# EasyEDA Pro project ProPrj_AIoT-NTU-Prototype_2026-03-28.epro, board Extension Board
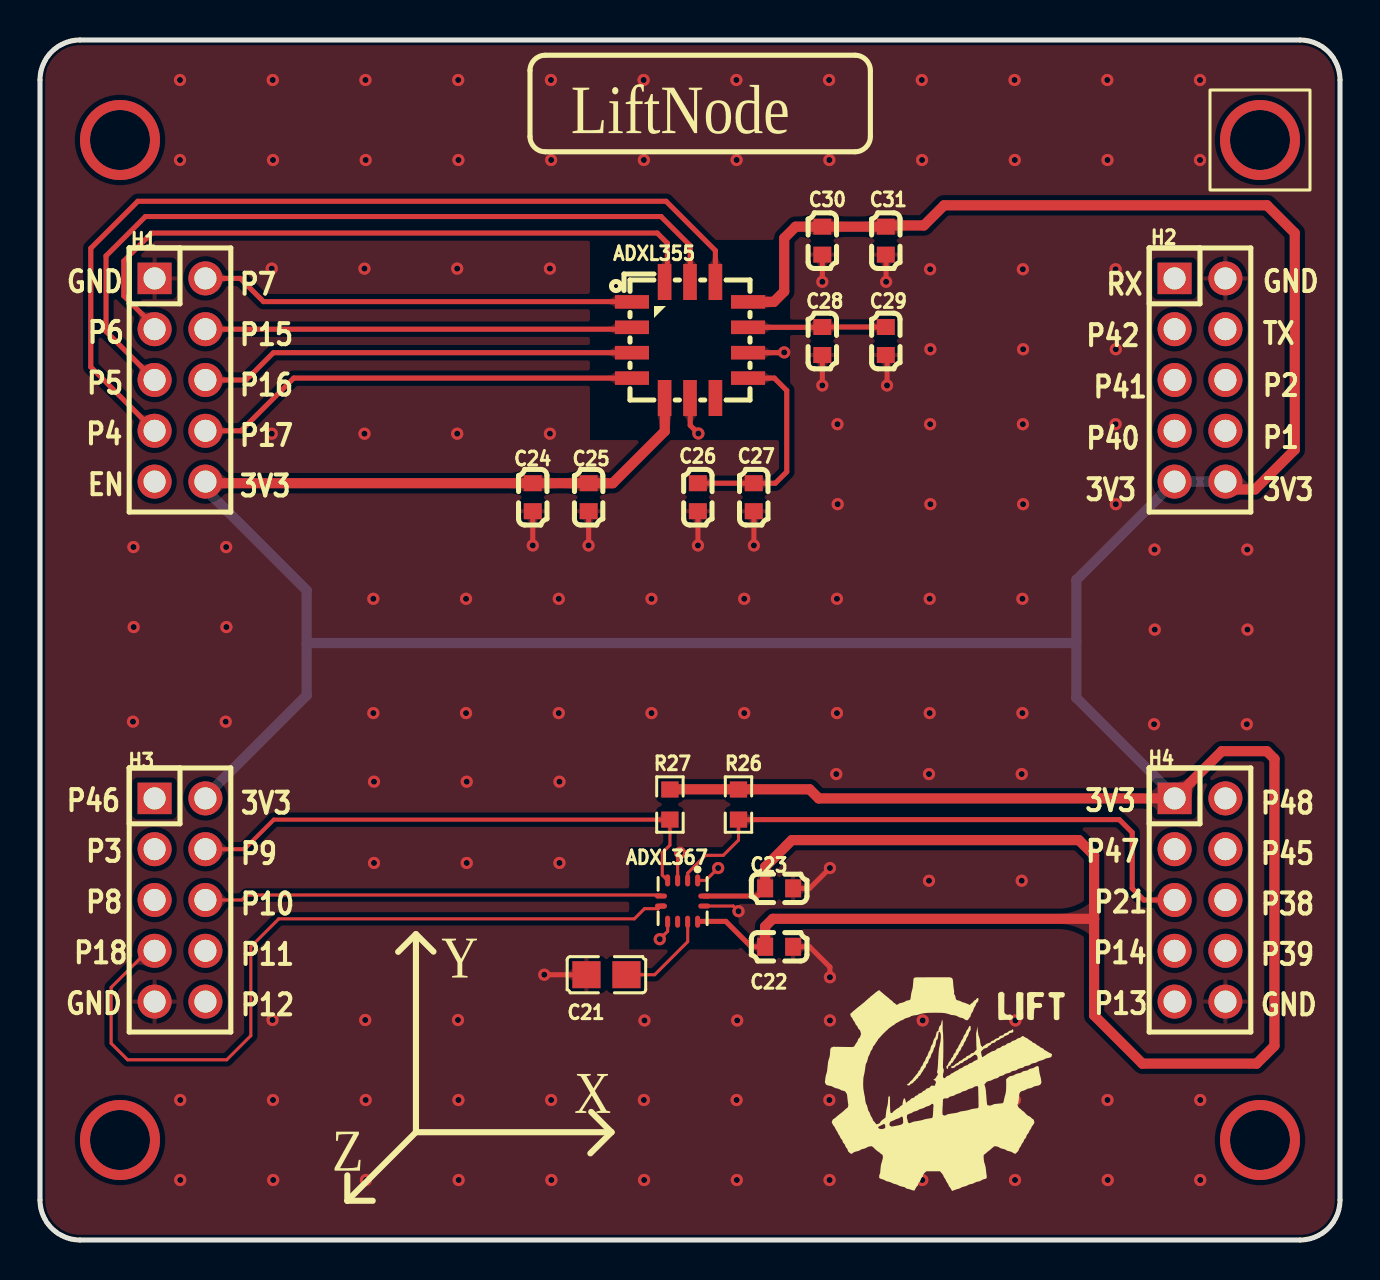
[diagram p5: board, top side]
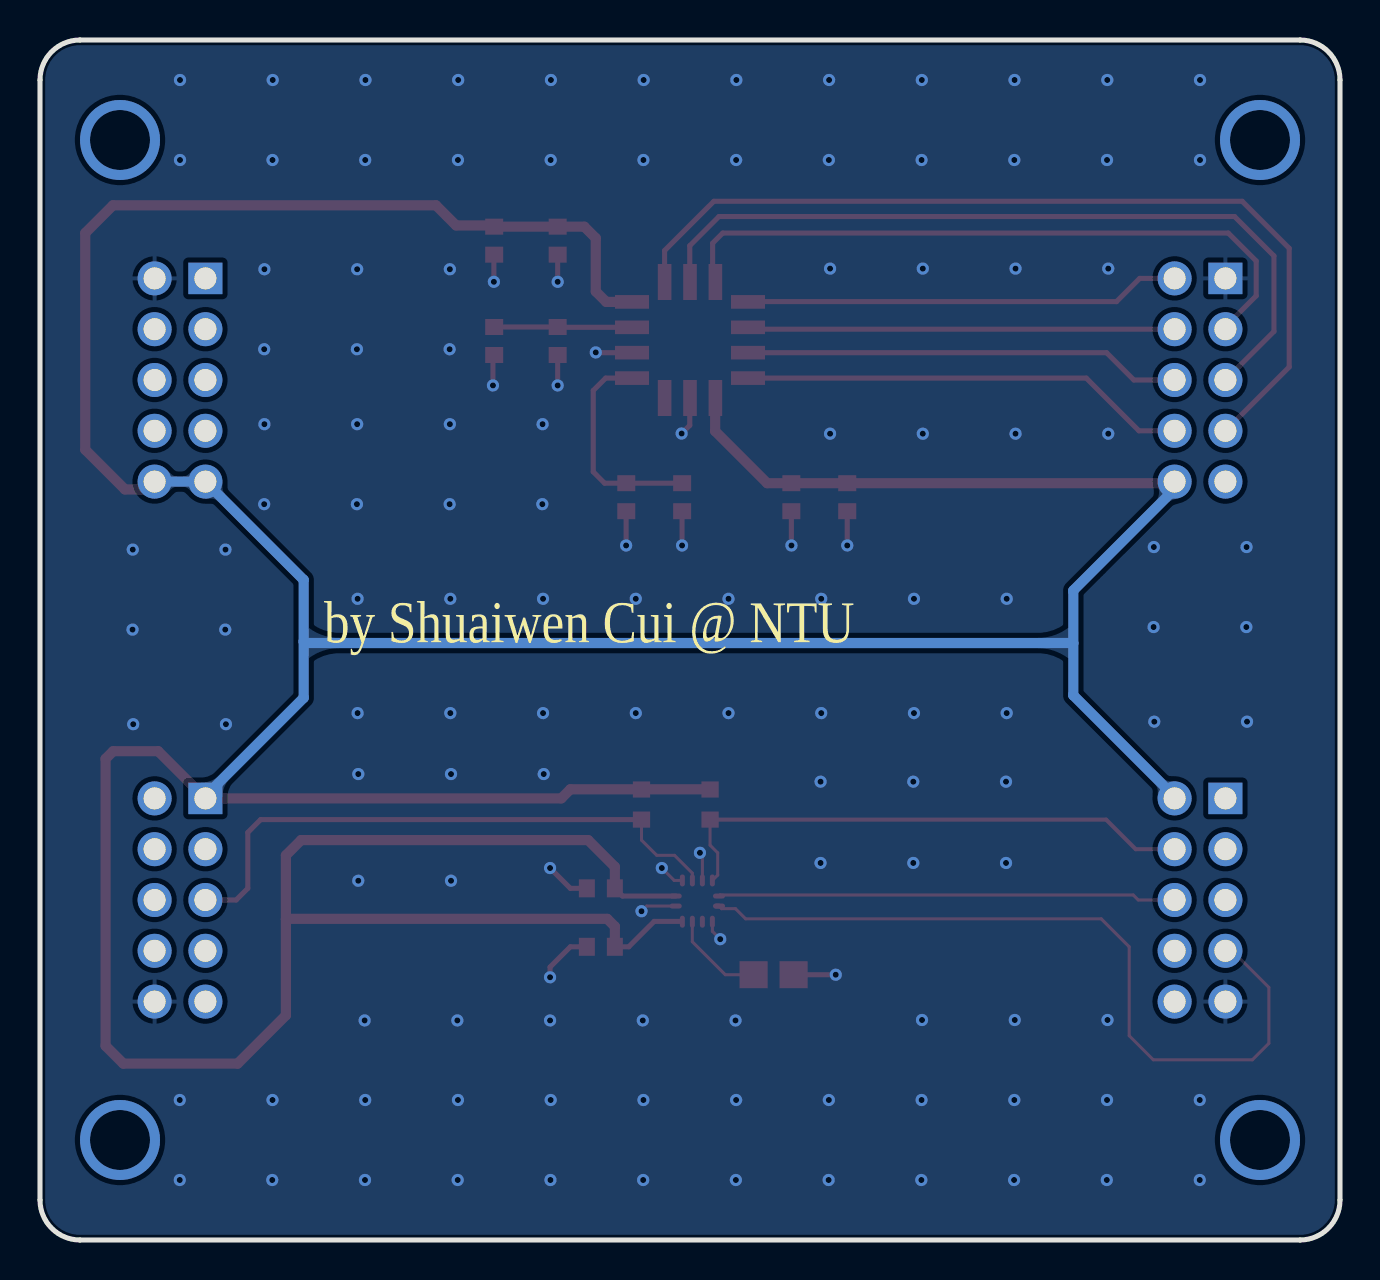
[diagram p6: board, bottom side, seen from below]

Outline 65 x 60 mm; copper layers: Top Layer, Bottom Layer. Coordinates in mm from the lower left corner of the outline.
Outline path: 0,58 0,2 arc(0.59,0.59) 2,0 63,0 arc(64.41,0.59) 65,2 65,58 arc(64.41,59.41) 63,60 2,60 arc(0.59,59.41) 0,58
Stack: Top Layer 0.035mm / Dielectric1 1.51mm FR4 er 4.5 / Bottom Layer 0.035mm

## Design rules (mm)
template: JLCPCB Capability(Two Layers Board)
spacing copperThickness1oz (default): track to track 0.102, other pairs 0.152 to 0.3
spacing copperThickness2oz: track to track 0.203, other pairs 0.152 to 0.3
track width copperThickness1oz (default): min 0.127, default 0.254, max 2.54
track width copperThickness2oz: min 0.203, default 0.254, max 2.54
differential pair differentialPair (default): width min 0.127, default 0.254, max 2.54; gap min 0.152, default 0.152
via viaSize (default): diameter min 0.5, default 0.61, max 10; hole min 0.3, default 0.305, max 6.3

## Placement (name value [footprint] x y rotation side)
ADXL355  ADXL355BEZ-RL7  [LCC-14_L6.0-W6.0-P1.27-TL]  32.5 45 0 top
ADXL367  ADXL367BCCZ-RL7  [LGA-12_L2.3-W2.2-P0.50-TL]  32.13 16.95 270 top
C21  200nF/50V(10%)  [C0805]  28.32 13.26 0 top
C22  100nF/50V(10%)  [C0603]  36.96 14.66 0 top
C23  100nF/50V(10%)  [C0603]  36.96 17.58 0 top
C24  1uF/16V(10%)  [C0603]  24.64 37.14 90 top
C25  100nF/50V(10%)  [C0603]  27.43 37.14 270 top
C26  1uF/16V(10%)  [C0603]  32.89 37.14 90 top
C27  100nF/50V(10%)  [C0603]  35.69 37.14 270 top
C28  100nF/50V(10%)  [C0603]  39.12 44.95 270 top
C29  1uF/16V(10%)  [C0603]  42.29 44.95 90 top
C30  100nF/50V(10%)  [C0603]  39.12 49.97 270 top
C31  1uF/16V(10%)  [C0603]  42.29 49.97 90 top
H1  DS1023-2*5SF11  [HDR-TH_10P-P2.54-V-F-R2-C5-S2.54]  7 43 270 top
H2  DS1023-2*5SF11  [HDR-TH_10P-P2.54-V-F-R2-C5-S2.54]  58 43 270 top
H3  DS1023-2*5SF11  [HDR-TH_10P-P2.54-V-F-R2-C5-S2.54]  7 17 270 top
H4  DS1023-2*5SF11  [HDR-TH_10P-P2.54-V-F-R2-C5-S2.54]  58 17 270 top
R26  4.7kΩ  [R0603]  34.93 21.77 270 top
R27  4.7kΩ  [R0603]  31.5 21.77 270 top

## Footprints (pads in the part's own frame, mm; a bottom-side part is the same pattern mirrored in y, then rotated)
C0603
  rect 0.8x0.9 smd: 1(-0.7,0) 2(0.7,0)
C0805
  rect 1.41x1.35 smd: 1(-1,0) 2(1,0)
HDR-TH_10P-P2.54-V-F-R2-C5-S2.54
  rect 1.575x1.7 hole 1.1: 1(-5.08,-1.27)
  round 1.7 hole 1.1: 2(-5.08,1.27) 3(-2.54,-1.27) 4(-2.54,1.27) 5(0,-1.27) 6(0,1.27) 7(2.54,-1.27) 8(2.54,1.27) 9(5.08,-1.27) 10(5.08,1.27)
LCC-14_L6.0-W6.0-P1.27-TL
  rect 1.7x0.68 smd: 1(-2.9,1.905) 2(-2.9,0.635) 3(-2.9,-0.635) 4(-2.9,-1.905) 8(2.9,-1.905) 9(2.9,-0.635) 10(2.9,0.635) 11(2.9,1.905)
  rect 0.68x1.8 smd: 5(-1.27,-2.9) 6(0,-2.9) 7(1.27,-2.9) 12(1.27,2.9) 13(0,2.9) 14(-1.27,2.9)
LGA-12_L2.3-W2.2-P0.50-TL
  oval 0.6x0.25 smd: 1(-1.032,0.75) 2(-1.032,0.25) 3(-1.032,-0.25) 4(-1.032,-0.75) 7(1.032,-0.75) 8(1.032,-0.25) 9(1.032,0.25) 10(1.032,0.75)
  oval 0.25x0.6 smd: 5(-0.25,-1.081) 6(0.25,-1.081) 11(0.25,1.081) 12(-0.25,1.081)
R0603
  rect 0.806x0.864 smd: 1(-0.753,0) 2(0.753,0)

## Nets
As in the schematic.

Pads without a net: ADXL355 7; ADXL367 8

## Via types
v1: diameter 4, hole 3, Top Layer to Bottom Layer, 4 vias
v2: diameter 0.61, hole 0.305, Top Layer to Bottom Layer, 134 vias

## Routing (per net, layer and track width the routed paths; a pad name or vN(x,y) marks a point on that pad's centre or on a via; arc(x,y) is an arc through that point)
GND: length 29.1
  Top Layer w0.152: ADXL367.7 31.38,15.44 v2(30.99,15.04) ; v2(34.93,16.44) 34.67,16.7 ADXL367.11 ; v2(32,19.36) 31.88,19.24 ADXL367.3 ; v2(33.91,18.6) 33.29,17.98 ADXL367.1
  Top Layer w0.254: C25.2 27.43,34.73 v2(27.43,34.73) ; v2(39.12,47.91) 39.12,49.27 ; v2(42.31,47.91) 42.31,49.25 C31.1 ; v2(39.12,42.73) C28.2 ; v2(37.21,44.38) 37.2,44.36 ADXL355.9 ; C23.2 38.48,17.58 v2(39.5,18.6) ; v2(32.92,40.32) 32.51,40.73 32.51,42.09 ADXL355.6 ; C26.1 32.9,36.44 v2(32.9,34.73) ; C29.1 42.35,44.19 v2(42.35,42.73) ; C21.1 v2(25.21,13.26) ; C27.2 35.69,36.43 v2(35.69,34.73) ; v2(39.5,13.14) 39.5,13.64 38.48,14.66 C22.2 ; v2(24.64,34.73) C24.1
  vias: v2(4.65,25.92) v2(4.67,34.65) v2(4.68,30.65) v2(7,58) v2(7,54) v2(7.01,7) v2(7.01,3) v2(9.31,34.65) v2(9.32,30.65) v2(9.29,25.92) v2(11.64,58) v2(11.65,54) v2(11.59,48.57) v2(11.59,40.31) v2(11.63,11) v2(11.65,7) v2(11.66,3) v2(16.22,48.57) v2(16.22,40.31) v2(16.27,58) v2(16.28,54) v2(16.26,11) v2(16.28,7) v2(16.3,3) v2(16.67,32.06) v2(16.67,26.34) v2(16.7,22.92) v2(16.7,18.85) v2(20.91,58) v2(20.92,54) v2(20.86,48.57) v2(20.86,40.31) v2(20.9,11) v2(20.92,7) v2(20.93,3) v2(21.3,32.06) v2(21.3,26.34) v2(21.34,22.92) v2(21.34,18.85) v2(25.55,58) v2(25.5,48.57) v2(25.5,40.31) v2(25.56,54) v2(25.56,7) v2(25.57,3) v2(25.94,32.06) v2(25.94,26.34) v2(25.97,22.92) v2(25.97,18.85) v2(30.18,58) v2(30.19,54) v2(30.22,10.98) v2(30.19,7) v2(30.21,3) v2(30.57,32.06) v2(30.57,26.34) v2(34.82,58) v2(34.83,54) v2(34.83,7) v2(34.84,3) v2(34.86,10.98) v2(35.21,32.06) v2(35.21,26.34) v2(39.45,58) v2(39.47,54) v2(39.5,10.98) v2(39.47,7) v2(39.48,3) v2(39.85,32.06) v2(39.85,26.34) v2(39.81,23.3) v2(39.87,40.79) v2(39.88,36.79) v2(44.09,58) v2(44.1,54) v2(44.13,10.98) v2(44.1,7) v2(44.12,3) v2(44.45,23.3) v2(44.45,17.96) v2(44.51,48.54) v2(44.52,44.54) v2(44.51,40.79) v2(44.52,36.79) v2(44.48,32.06) v2(44.48,26.34) v2(48.73,58) v2(48.74,54) v2(48.74,7) v2(48.77,10.98) v2(48.75,3) v2(49.14,48.54) v2(49.14,40.79) v2(49.12,32.06) v2(49.12,26.34) v2(49.09,23.3) v2(49.09,17.96) v2(49.16,44.54) v2(49.16,36.79) v2(53.36,58) v2(53.38,54) v2(53.38,7) v2(53.39,3) v2(53.78,48.54) v2(53.79,44.54) v2(53.78,40.79) v2(53.79,36.79) v2(55.73,34.52) v2(55.74,30.52) v2(55.7,25.79) v2(58,58) v2(58,54) v2(58.01,7) v2(58.01,3) v2(60.34,25.79) v2(60.36,34.52) v2(60.37,30.52)
(no net):
  vias: v1(4,55) v1(4,5) v1(61,55) v1(61,5)
ESP_3V3: length 260.9
  Top Layer w0.254: C22.1 35.56,14.66 34.29,15.93 32.95,15.93 32.93,15.94 ; C23.1 35.87,17.2 ADXL367.12
  Top Layer w0.508: 52.71,16.04 52.71,19.23 51.94,20 37.59,20 36.26,18.66 C23.1 ; 52.71,16.04 52.69,16.06 36.64,16.06 36.26,15.68 C22.1 ; 52.71,16.04 52.71,11.23 55.12,8.82 60.83,8.82 61.72,9.71 61.72,24.06 61.34,24.44 59.09,24.44 H4.1 38.94,22.08 38.48,22.53 31.5,22.53 R27.1 ; 37.78,50.67 C30.1 C31.2 42.35,50.73 44.2,50.73 45.2,51.73 61.35,51.73 62.74,50.35 62.74,39.51 60.75,37.53 59.53,37.53 59.27,37.79 H2.10 ; ADXL355.5 31.24,42.09 31.24,40.44 28.64,37.84 C25.1 C24.2 8.35,37.84 H1.10 ; 37.78,50.67 37.21,50.09 37.21,47.43 36.69,46.91 ADXL355.11
  Bottom Layer w0.508: 13.34,29.85 13.34,32.47 8.27,37.54 H1.10 ; 13.34,29.85 13.34,27.23 8.27,22.17 H3.2 ; 13.34,29.85 51.75,29.85 51.82,29.92 ; H4.1 56.73,22.19 51.82,27.11 51.82,29.92 ; 51.82,29.92 51.82,33.01 H2.9 H2.10
GPIO4: length 45.2
  Top Layer w0.254: ADXL355.12 33.77,49.47 31.31,51.94 4.89,51.94 2.54,49.59 2.54,43.65 H1.7
GPIO5: length 39.7
  Top Layer w0.254: H1.5 3.3,45.43 3.3,49.2 5.27,51.17 31.05,51.17 32.51,49.71 32.51,47.91 ADXL355.13
GPIO6: length 34.1
  Top Layer w0.254: H1.3 5.73,45.67 4.19,47.21 4.19,48.95 5.59,50.35 30.86,50.35 31.37,49.84 31.37,47.91 31.36,47.9 ADXL355.14
GPIO7: length 21.8
  Top Layer w0.254: ADXL355.1 29.59,46.92 11.18,46.92 10.01,48.08 H1.2
GPIO9: length 27.1
  Top Layer w0.152: ADXL367.4 31.12,18.24 31.12,19.36 31.5,19.74 R27.2
  Top Layer w0.203: H3.4 10.21,19.54 11.69,21.02 R27.2
GPIO10: length 22.9
  Top Layer w0.152: ADXL367.5 31,17.25 10.34,17.25 10.09,17 H3.6
GPIO15: length 21.4
  Top Layer w0.254: H1.4 29.5,45.54 ADXL355.2
GPIO16: length 21.9
  Top Layer w0.254: ADXL355.3 11.67,44.36 10.31,43 H1.6
GPIO17: length 22.4
  Top Layer w0.254: H1.8 10.05,40.46 12.69,43.09 ADXL355.4
GPIO18: length 39.5
  Top Layer w0.152: H3.7 5.39,14.46 3.56,12.63 3.56,9.84 4.38,9.01 9.33,9.01 10.54,10.22 10.54,14.66 11.94,16.06 29.72,16.06 30.23,16.57 30.92,16.57 ADXL367.6
  Top Layer w0.254: 31.18,16.7 ADXL367.6
GPIO21: length 29.8
  Top Layer w0.152: 32.38,17.86 32.38,18.34 33.27,19.23 34.16,19.23 34.93,20 R26.2
  Top Layer w0.254: R26.2 53.97,21.02 54.61,20.38 54.61,17.58 55.19,17 H4.5
$1N763: length 4.6
  Top Layer w0.152: C21.2 30.73,13.26 32.38,14.92 32.38,15.79
$1N767: length 10.9
  Top Layer w0.254: C26.2 C27.1 36.77,37.84 37.34,38.41 37.34,42.47 36.72,43.09 ADXL355.8
$1N769: length 6.9
  Top Layer w0.254: C29.2 C28.1 39.1,45.64 ADXL355.10

## Copper pours and planes (outline as drawn; the poured copper is in the pictures)
GND on Top Layer: -3.81,62.16 68.58,62.16 68.58,-3.25 -3.81,-3.25
GND on Bottom Layer: -2.92,62.03 67.94,62.03 67.94,-2.99 -2.92,-2.99

Small or netless copper shapes (teardrops, artwork), in the pictures only: 87 on Top Layer, 8 on Bottom Layer

## Text on the board
Bottom Silkscreen Layer: by Shuaiwen Cui @ NTU
Top Silkscreen Layer: GND | P46 | P18 | P3 | P8 | P4 | P5 | P6 | EN | P7 | P15 | P16 | P17 | 3V3 | P9 | P10 | P11 | P12 | P47 | P42 | P40 | P14 | P41 | P21 | P13 | RX | P48 | P45 | P38 | P39 | TX | P2 | P1 | Z | Y | X | LiftNode
